# Altium project ControleEsp32.PrjPcb
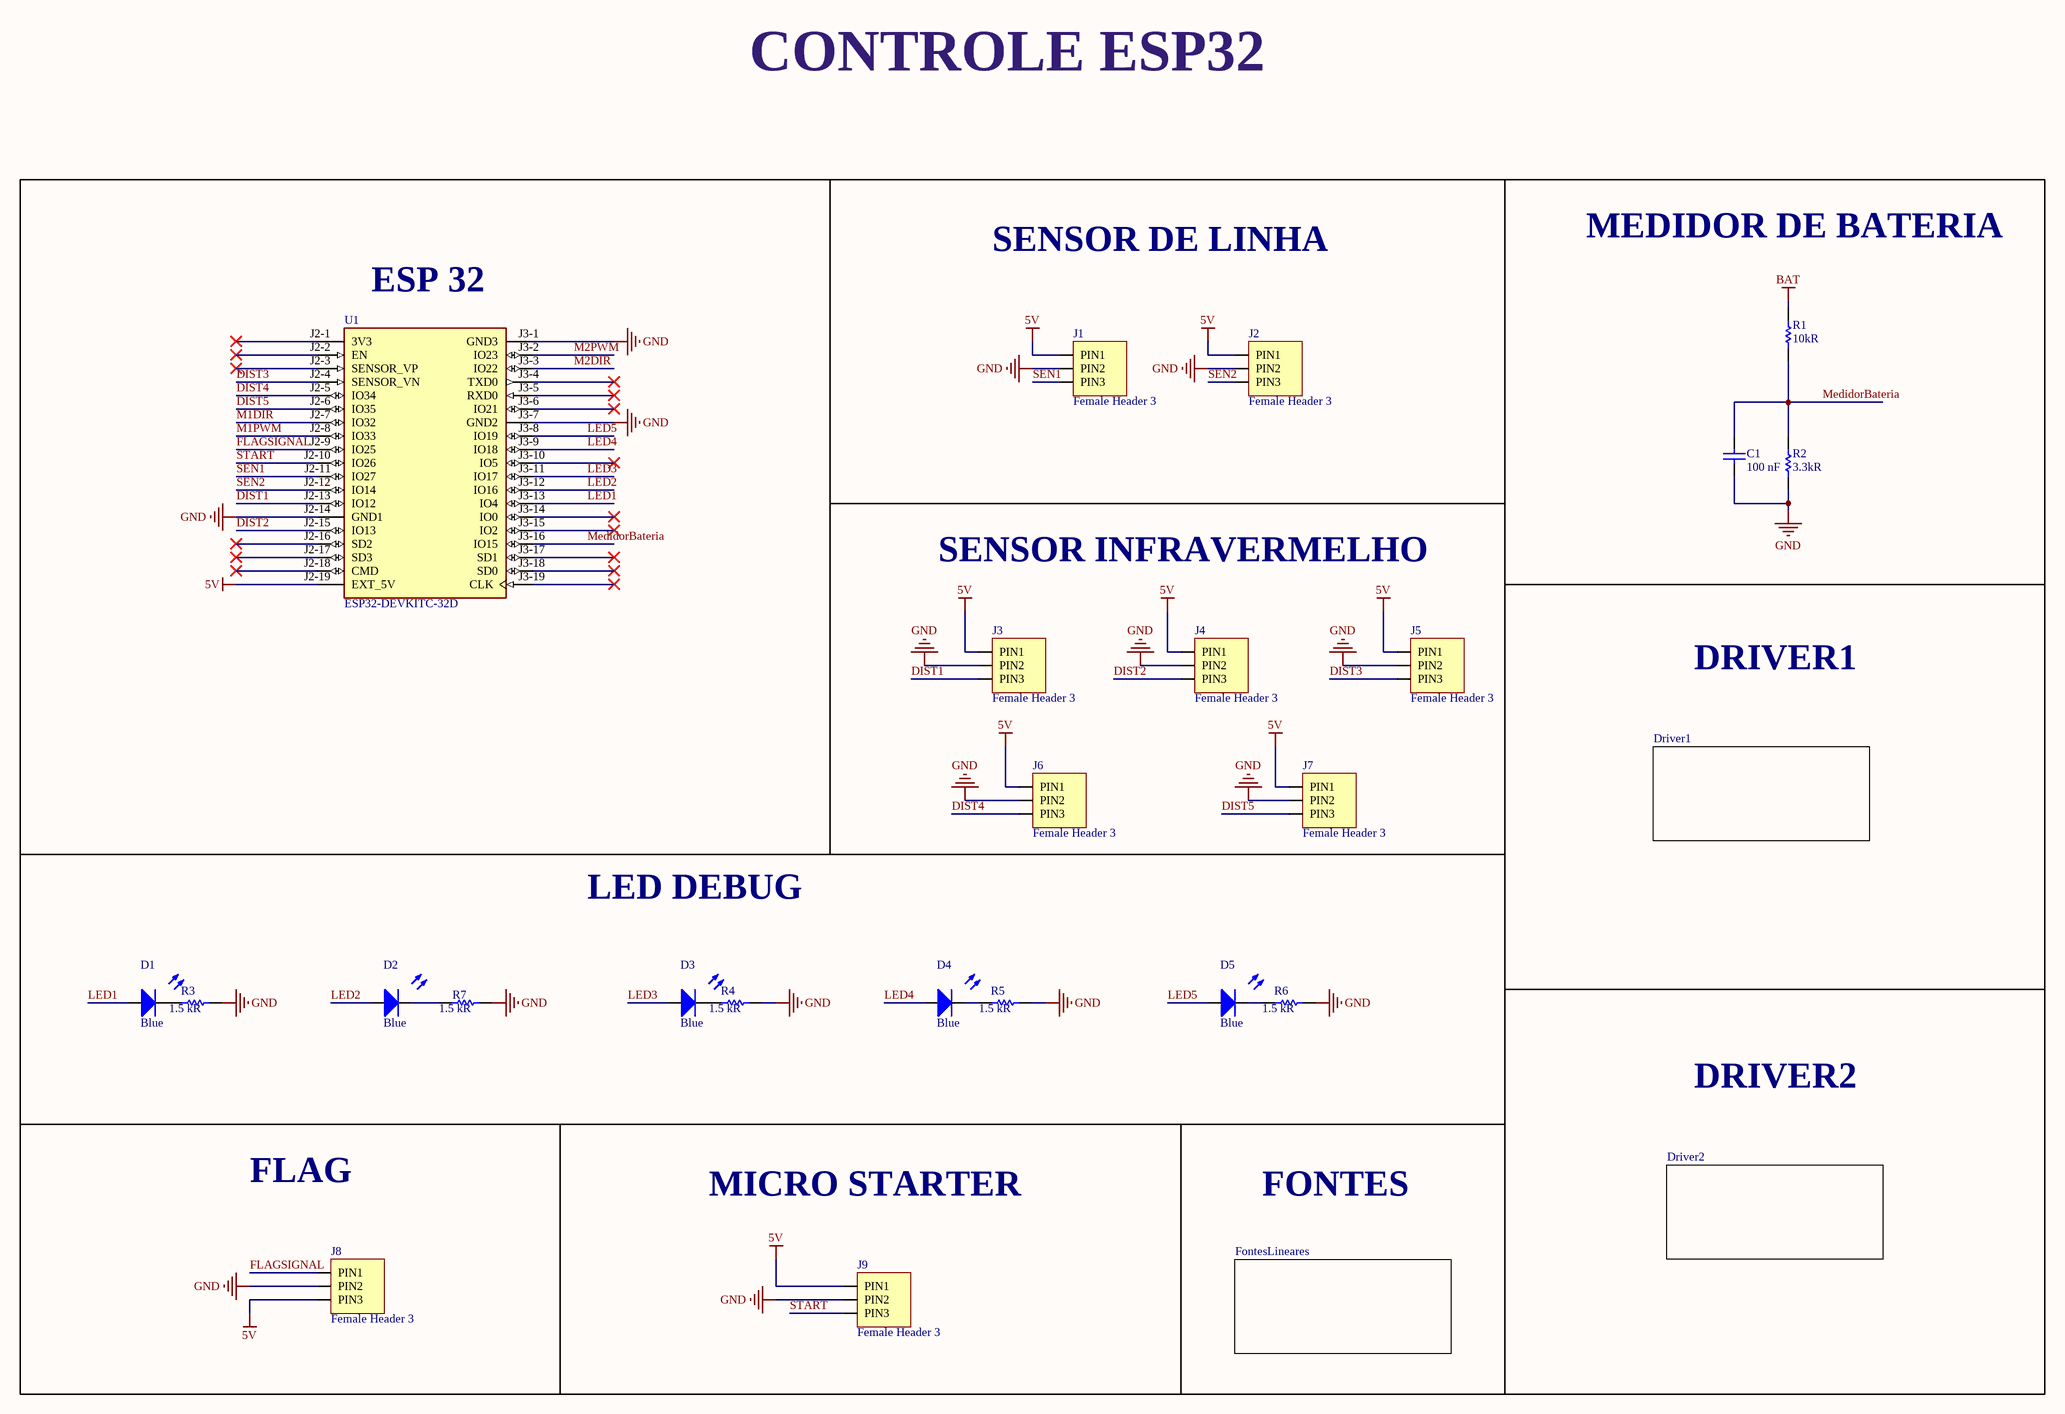
[diagram p0: controleEsp32.SchDoc]
4 sheets, 46 parts. Net scope: global (net labels, ports and power ports of the same name join across sheets).
Board file: ControleEsp32.PcbDoc
Sheets:
  controleEsp32.SchDoc
    FontesLineares = Fonteslineares.SchDoc
    FontesLineares = Driver1.SchDoc
    FontesLineares = Driver2.SchDoc

## Sheet controleEsp32.SchDoc
size A2; SheetNumber: 1; SheetTotal: 4

### Parts
C1  100 nF  [C0805]
D1  Blue  [DIODO_2-SMD-3215]
D2  Blue  [DIODO_2-SMD-3215]
D3  Blue  [DIODO_2-SMD-3215]
D4  Blue  [DIODO_2-SMD-3215]
D5  Blue  [DIODO_2-SMD-3215]
J1  Female Header 3  [FEMALE HEADER 3]
J2  Female Header 3  [FEMALE HEADER 3]
J3  Female Header 3  [FEMALE HEADER 3]
J4  Female Header 3  [FEMALE HEADER 3]
J5  Female Header 3  [FEMALE HEADER 3]
J6  Female Header 3  [FEMALE HEADER 3]
J7  Female Header 3  [FEMALE HEADER 3]
J8  Female Header 3  [FEMALE HEADER 3]
J9  Female Header 3  [FEMALE HEADER 3]
R1  10kR  [RESISTOR_0603]
R2  3.3kR  [RESISTOR_0603]
R3  1.5 kR  [RESISTOR_0805]
R4  1.5 kR  [RESISTOR_0805]
R5  1.5 kR  [RESISTOR_0805]
R6  1.5 kR  [RESISTOR_0805]
R7  1.5 kR  [RESISTOR_0805]
U1  ESP32-DEVKITC-32D  [MODULE_ESP32-DEVKITC-32D]

### Sub-sheets
FontesLineares = FontesLineares: no entries
FontesLineares = Driver1: no entries
FontesLineares = Driver2: no entries

### Nets
5V: J1.PIN1 J2.PIN1 J3.PIN1 J4.PIN1 J5.PIN1 J6.PIN1 J7.PIN1 J8.PIN3 J9.PIN1 U1.J2-19(EXT_5V)
BAT: R1.2
GND: C1.1 J1.PIN2 J2.PIN2 J3.PIN2 J4.PIN2 J5.PIN2 J6.PIN2 J7.PIN2 J8.PIN2 J9.PIN2 R2.1 R3.2 R4.2 R5.2 R6.2 R7.2 U1.J2-14(GND1) U1.J3-1(GND3) U1.J3-7(GND2)
DIST1: J3.PIN3 U1.J2-13(IO12)
DIST2: J4.PIN3 U1.J2-15(IO13)
DIST3: J5.PIN3 U1.J2-4(SENSOR_VN)
DIST4: J6.PIN3 U1.J2-5(IO34)
DIST5: J7.PIN3 U1.J2-6(IO35)
FLAGSIGNAL: J8.PIN1 U1.J2-9(IO25)
LED1: D1.A U1.J3-13(IO4)
LED2: D2.A U1.J3-12(IO16)
LED3: D3.A U1.J3-11(IO17)
LED4: D4.A U1.J3-9(IO18)
LED5: D5.A U1.J3-8(IO19)
M1DIR: U1.J2-7(IO32)
M1PWM: U1.J2-8(IO33)
M2DIR: U1.J3-3(IO22)
M2PWM: U1.J3-2(IO23)
MedidorBateria: C1.2 R1.1 R2.2 U1.J3-16(IO15)
SEN1: J1.PIN3 U1.J2-11(IO27)
SEN2: J2.PIN3 U1.J2-12(IO14)
START: J9.PIN3 U1.J2-10(IO26)
NetD1_C: D1.C R3.1
NetD2_C: D2.C R7.1
NetD3_C: D3.C R4.1
NetD4_C: D4.C R5.1
NetD5_C: D5.C R6.1

Not connected (* = marked no-connect by the designer): U1 J2-1(3V3)* J2-2(EN)* J2-3(SENSOR_VP)* J2-16(SD2)* J2-17(SD3)* J2-18(CMD)* J3-4(TXD0)* J3-5(RXD0)* J3-6(IO21)* J3-10(IO5)* J3-14(IO0)* J3-15(IO2)* J3-17(SD1)* J3-18(SD0)* J3-19(CLK)*

### Notes on the sheet
- CONTROLE ESP32
- SENSOR DE LINHA
- MEDIDOR DE BATERIA
- (near U1) ESP 32
- SENSOR INFRAVERMELHO
- DRIVER1
- LED DEBUG
- DRIVER2
- FLAG
- MICRO STARTER
- FONTES

### Library data of the parts
C1 = 885012207128: CAP CER 100 nF 100V X7R 0805; Manufacturer: Wurth Elektronik; Tolerance: 10%; Voltage - Rated: 100 VDC; Library Control - Checked Footprint: Yes; Supplier 1: Mouser; Part Number: 885012207128; Category: Ceramic capacitor; Price: 1=0,41 10=0,283 100=0,169 1000=0,107 (USD); Supplier Part Number 1: 710-885012207128; Library Ref: Capacitor; Operating Temperature: -55°C ~125ºC; Package / Case: 0805(2012 Metric); Size / Dimension: 2 mm L  x 1.25 mm W x 1.25 mm H; Value: 100 nF; ESR: -; Dieletric: X7R; Library Control - Checked Schematic: Yes; ComponentLink1Description: Datasheet; ComponentLink1URL: https://br.mouser.com/datasheet/2/445/885012207128-1727772.pdf; ComponentLink2Description: Mouser Link; ComponentLink2URL: https://br.mouser.com/ProductDetail/Wurth-Elektronik/885012207128?qs=MLItCLRbWsys1TnbPEYt%252BQ%3D%3D
D1-D5 = EAST3215BA5: LED 75mW BLUE 45MCD 3215; Manufacturer: Everlight Electronics; Current - Forward (If): 20 mA; Voltage - Forward (Vf): 3,30 V; Viewing Angle: 130°; Wavelength: 468 nm; Reverse Voltage: 5 V; Library Control - Checked Footprint: yes; Library Control - Person that Checked Footprint: Lucas; Library Control - Person that did the Last Update Footprint: Stéfany (Ster); Supplier 1: Mouser; Part Number: EAST3215BA5; Category: Standard LEDs - SMD; Price: 1 = 0,3800, 10 = 0,2050, 100 = 0.1080 (USD); Package / Case: 3215; Color: Blue; Operating Temperature: - 40 °C ~ 85 °C; Luminous Intensity: 45 mcd; Library Ref: Diodo/Led; Supplier Part Number 1: 638-EAST3215BA5; Max Power Dissipation: 75 mW; Max Current Rating: 20 mA; Library Control - Checked Schematic: yes; Library Control - Last Update: 13/06/2021 12:45; Library Control - Person that Checked Schematic: Lucas; Library Control - Person that did the Last Update Schematic: Stéfany (Ster); ComponentLink1Description: Mouser Link; ComponentLink1URL: https://www.mouser.com/ProductDetail/Everlight/EAST3215BA5?qs=Cqqh%252BS766wnzp9nQVj5A4g==; ComponentLink2Description: Datasheet; ComponentLink2URL: https://www.mouser.com/datasheet/2/143/EAST3215BA5-1154292.pdf
J1-J9 = Female Header 3: Number of Contacts: 3; System: Connector; Library Ref: Header
R1 = RC0603JR-0710KL: RES SMD 10K OHM 5% 1/10W 0603; Manufacturer: Yageo; Temperature Coefficient: 100 PPM / C; Power Rating: 100 mW (1/10 W); Voltage Rating: 75 V; Library Control - Checked Footprint: No; Library Control - Checked Schematic: Yes; Library Control - Person that Checked Schematic: Marcos; Library Control - Person that did the Last Update Footprint: Dalarme; Supplier 1: Mouser; Part Number: RC0603JR-0710KL; Category: Thick Film Resistors - SMD; Price: 1=0,10, 10=0,015, 100=0,005 1000=0,0040 (USD); Package / Case: 0603 (1608 Metric); Operating Temperature: - 55ºC ~ 155ºC; Value: 10kR; Tolerance: 5 %; Library Ref: Resistor; Resistor Type: Fixo; Size / Dimension: 1.6 mm L x  0.8 mm W x  0.45 mm H; Supplier Part Number 1: 603-RC0603JR-0710KL; Library Control - Last Update: 21/06/21 14:15; Library Control - Person that did the Last Update Schematic: Marcos; ComponentLink1Description: Mouser Link; ComponentLink1URL: https://br.mouser.com/ProductDetail/Yageo/RC0603JR-0710KL?qs=ksOUTF%2FWcd8D6T22BJkQ7g%3D%3D; ComponentLink2Description: Datsheet Link; ComponentLink2URL: https://br.mouser.com/datasheet/2/447/Yageo_03_18_2021_PYu_RC_Group_51_RoHS_L_11-2199992.pdf
R2 = CRGCQ0603F3K3: RES SMD 3.3K OHM 1% 1/10W 0603; Manufacturer: TE Connectivity / Holsworthy; Temperature Coefficient: 100 PPM / C; Power Rating: 100 mW (1/10 W); Voltage Rating: 75 V; Library Control - Checked Footprint: Yes; Library Control - Person that Checked Footprint: Nikaum; Library Control - Person that Checked Schematic: Guilherme; Library Control - Person that did the Last Update Footprint: Dalarme; Supplier 1: Mouser; Part Number: CRGCQ0603F3K3; Category: Thick Film Resistors; Price: 1=0,10, 10=0,029, 100=0,011 (USD); Package / Case: 0603 (1608 Metric); Operating Temperature: - 55ºC ~ 125ºC; Value: 3.3kR; Tolerance: 1 %; Library Ref: Resistor; Resistor Type: Fixed; Size / Dimension: 1.6 mm L x  0.8 mm W x  0.45 mm H; Supplier Part Number 1: 279-CRGCQ0603F3K3; Library Control - Checked Schematic: Yes; Library Control - Last Update: 27/06/2021 20:27; Library Control - Person that did the Last Update Schematic: Dalarme; ComponentLink1Description: Mouser Link; ComponentLink1URL: https://br.mouser.com/ProductDetail/TE-Connectivity-Holsworthy/CRGCQ0603F3K3?qs=sGAEpiMZZMvdGkrng054t7z4BkURc4Lz7mzhBruKq8fwVJ16OlxZFQ%3D%3D; ComponentLink2Description: Datasheet; ComponentLink2URL: https://br.mouser.com/datasheet/2/418/4/NG_DS_1773204-3_1-1358553.pdf
R3-R7 = CRCW08051K50FKEAC: RES SMD 1.5K OHM 1% 1/8W 0805; Manufacturer: Vishay / Dale; Temperature Coefficient: 100 PPM / C; Power Rating: 125 mW (1/8 W); Voltage Rating: 150 V; Library Control - Checked Footprint: Yes; Library Control - Person that Checked Footprint: Nikaum; Library Control - Person that did the Last Update Footprint: Nicolas; Supplier 1: Mouser; Part Number: CRCW08051K50FKEAC; Category: Thick Film Resistors - SMD; Price: 1=0,10, 10=0,059, 100=0,024 (USD); Package / Case: 0805 (2012 Metric); Operating Temperature: -55 C ~ 155 C; Value: 1.5 kR; Tolerance: 1 %; Library Ref: Resistor; Resistor Type: Fixo; Size / Dimension: 2,00 L x 1,25 W x 0,45 H; Supplier Part Number 1: 71-CRCW08051K50FKEAC; Library Control - Checked Schematic: Yes; Library Control - Last Update: 27/06/2021 20:45; Library Control - Person that Checked Schematic: Nikaum; Library Control - Person that did the Last Update Schematic: Nikaum; ComponentLink1Description: Mouser Link; ComponentLink1URL: https://br.mouser.com/ProductDetail/Vishay-Dale/CRCW08051K50FKEAC?qs=E3Y5ESvWgWMwo6R2oqPQ9Q%3D%3D; ComponentLink2Description: Datasheet; ComponentLink2URL: https://br.mouser.com/datasheet/2/427/crcwce3-1762584.pdf
U1 = CMP-041-000000-1: WiFi Development Tools (802.11) ESP32 General Development Kit, ESP32-WROOM-32D on the board; MF: Espressif Systems; Design Item ID: ESP32-DEVKITC-32D; Pin Count: 38; Component Type: Standard; Package: None; SnapEDA_Link: https://www.snapeda.com/parts/ESP32-DEVKITC-32D/Espressif+Systems/view-part/?ref=snap; Source: ESP32-DEVKITC-32D.SchLib; Check_prices: https://www.snapeda.com/parts/ESP32-DEVKITC-32D/Espressif+Systems/view-part/?ref=eda; MP: ESP32-DEVKITC-32D; Value: *

## Sheet Fonteslineares.SchDoc
size A4; SheetNumber: 2; SheetTotal: 4
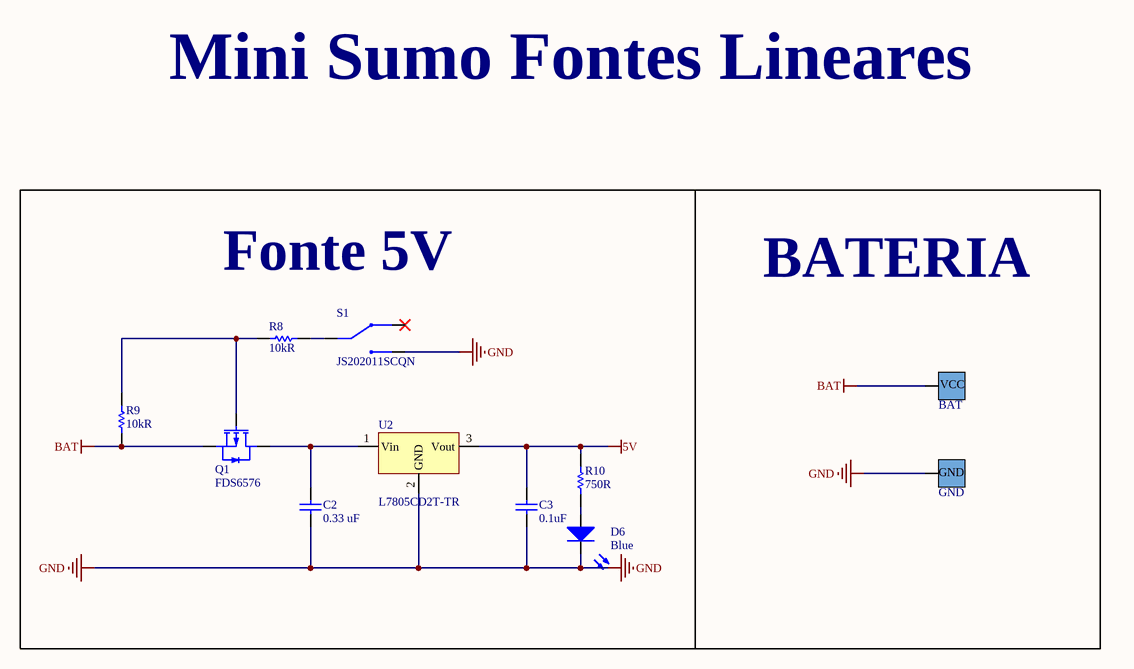
[diagram p1: Fonteslineares.SchDoc]

### Parts
BAT  Source Pad  [PAD_ALIMENTAÇÃO_MINI]  (value not drawn)
C2  0.33 uF  [C0805]
C3  0.1uF  [C0805]
D6  Blue  [DIODO_2-SMD-3215]
GND  Ground Pad  [PAD_ALIMENTAÇÃO_MINI]  (value not drawn)
Q1  FDS6576  [SOIC-8]
R8  10kR  [RESISTOR_0603]
R9  10kR  [RESISTOR_0603]
R10  750R  [RESISTOR_0805]
S1  JS202011SCQN  [DPDT]
U2  L7805CD2T-TR  [D2PAK]

### Nets
5V: C3.2 R10.2 U2.3(Vout)
BAT: BAT.A(VCC) Q1.S R9.1
GND: C2.1 C3.1 D6.C GND.A(GND) S1.A3 U2.2(GND)
NetC2_2: C2.2 Q1.D U2.1(Vin)
NetD6_A: D6.A R10.1
NetQ1_G: Q1.G R8.2 R9.2
NetR8_1: R8.1 S1.A1

Not connected (* = marked no-connect by the designer): S1 A2(4)*

### Notes on the sheet
- Mini Sumo Fontes Lineares
- Fonte 5V
- BATERIA

### Library data of the parts
BAT = Source Pad Mini Sumô: VCC PAD MINI SUMÔ; Cable AWG: 20 / 18 (AWG); Recomended Category: Mini Sumô; Size: 3.5 x 3.5 (mm); Library Ref: Pads
C2 = GCM21BR71E334KA37K: CAP CER 0.33UF 25V X7R 0805; Manufacturer: Murata Eletronics; Tolerance: 10%; Voltage - Rated: 25 VDC; Library Control - Checked Footprint: Yes; Library Control - Person that Checked Footprint: Nikaum; Supplier 1: Mouser; Part Number: GCM21BR71E334KA37K; Category: Ceramic Capacitor; Price: 1= 0,57, 10= 0,398, 100= 0,239 (USD); Supplier Part Number 1: 81-GCM21BR71E334KA7K; Library Ref: Capacitor; Operating Temperature: -55 C ~ 125 C; Package / Case: 0805 (2012 Metric); Size / Dimension: 2,00 L x 1,25 W x 1,25 H; Value: 0.33 uF; Dieletric: X7R; Library Control - Checked Schematic: Yes; Library Control - Last Update: 28/06/2021 00:57; Library Control - Person that Checked Schematic: Nikaum; Library Control - Person that did the Last Update Footprint: Nikaum; Library Control - Person that did the Last Update Schematic: Nikaum; ComponentLink1Description: Datasheet; ComponentLink1URL: https://br.mouser.com/datasheet/2/281/GCM21BR71E334KA37_01-1968656.pdf; ComponentLink2Description: Mouser Link; ComponentLink2URL: https://br.mouser.com/ProductDetail/Murata-Electronics/GCM21BR71E334KA37K?qs=N3Kl9KD794Tg%2FXM5q2uFQQ%3D%3D; ComponentLink3Description: ESR; ComponentLink3URL: https://www.murata.com/en-us/products/productdetail?partno=GCM21BR71E334KA37%23
C3 = C0805C104M3RACTU: CAP CER 0.1uF 25V X7R 0805; Manufacturer: Kemet; Tolerance: 20%; Voltage - Rated: 25 VDC; Library Control - Checked Footprint: No; Library Control - Checked Schematic: Yes; Library Control - Person that Checked Schematic: Guilherme; Library Control - Person that did the Last Update Schematic: Marcos; Supplier 1: Mouser; Part Number: C0805C104M3RACTU; Category: Ceramic Capacitor; Price: 1=0,13 10=0,064 100=0,037 1000=0,025 (USD); Supplier Part Number 1: 80-C0805C104M3R; Library Ref: Capacitor; Operating Temperature: -55 C ~ 125 C; Package / Case: 0805(2012 mestric); Size / Dimension: 1.25 mm W x 2 mm L x 0.78 mm H; Value: 0.1uF; ESR: -; Dieletric: X7R; Library Control - Last Update: 26/06/2021 20:52; ComponentLink1Description: Datasheet; ComponentLink1URL: https://br.mouser.com/datasheet/2/212/KEM_C1002_X7R_SMD-1102033.pdf; ComponentLink2Description: Mouser Link; ComponentLink2URL: https://br.mouser.com/ProductDetail/KEMET/C0805C104M3RACTU?qs=jbCUrP3sAgSIdMuvv9W4Pg%3D%3D
D6 = EAST3215BA5: as D1 on sheet controleEsp32; Supplier 1: Mouser; Part Number: EAST3215BA5; Category: Standard LEDs - SMD; Price: 1 = 0,3800, 10 = 0,2050, 100 = 0.1080 (USD); Package / Case: 3215; Color: Blue; Operating Temperature: - 40 °C ~ 85 °C; Luminous Intensity: 45 mcd; Library Ref: Diodo/Led; Supplier Part Number 1: 638-EAST3215BA5; Max Power Dissipation: 75 mW; Max Current Rating: 20 mA; Library Control - Checked Schematic: yes; Library Control - Last Update: 13/06/2021 12:45; Library Control - Person that Checked Schematic: Lucas; Library Control - Person that did the Last Update Schematic: Stéfany (Ster); ComponentLink1Description: Mouser Link; ComponentLink1URL: https://www.mouser.com/ProductDetail/Everlight/EAST3215BA5?qs=Cqqh%252BS766wnzp9nQVj5A4g==; ComponentLink2Description: Datasheet; ComponentLink2URL: https://www.mouser.com/datasheet/2/143/EAST3215BA5-1154292.pdf
GND = Ground Pad Mini Sumô: GND PAD MINI SUMÔ; Cable AWG: 20 / 18 (AWG); Recomended Category: Mini Sumô; Size: 3.5 x 3.5 (mm); Library Ref: Pads
Q1 = FDS6576: MOSFET P-CH 20V 11A SOIC-8; Manufacturer: onsemi / Fairchild; FET Type: P-Channel; Rds On (Max) @ Id, Vgs: 23mOhms @ -11A, -4.5V; Input Capacitance (Ciss) (Max) @Vds: 4044pF@-10V; Drain to Source Voltage (Vds): -20V; Vgs(th) (Max) Id: -1.5V@-250uA; Current - Continuous Drain (Id) @25°C: -11A; Gate Charge (Qg) (Max) @ Vgs: 60nC@-4.5V; Power Dissipation (Max): 2.5W; Drive Voltage (Max Rds On, Min Rds On): -2.5V ~4.5V; Vgs (Max): 12V; Rise / Fall Time (Typ): 17 / 79 (ns); Part Number: SOIC-8; Price: 1=1.34, 10=1.20, 100=0.932, 500=0.77, 1000=0.608 (USD); Package / Case: SOIC-8; Operating Temperature: -55 °C ~150 °C; Supplier 1: Mouser; Library Ref: Mosfet; Supplier Part Number 1: 512-FDS6576; ComponentLink1Description: Datasheet; ComponentLink1URL: https://br.mouser.com/datasheet/2/308/1/FDS6576_D-1808687.pdf; ComponentLink2Description: Mouser; ComponentLink2URL: https://br.mouser.com/ProductDetail/onsemi-Fairchild/FDS6576?qs=FOlmdCx%252BAA1N14vq5QZP7Q%3D%3D
R8 R9 = RC0603JR-0710KL: as R1 on sheet controleEsp32; Supplier 1: Mouser; Part Number: RC0603JR-0710KL; Category: Thick Film Resistors - SMD; Price: 1=0,10, 10=0,015, 100=0,005 1000=0,0040 (USD); Package / Case: 0603 (1608 Metric); Operating Temperature: - 55ºC ~ 155ºC; Value: 10kR; Tolerance: 5 %; Library Ref: Resistor; Resistor Type: Fixo; Size / Dimension: 1.6 mm L x  0.8 mm W x  0.45 mm H; Supplier Part Number 1: 603-RC0603JR-0710KL; Library Control - Last Update: 21/06/21 14:15; Library Control - Person that did the Last Update Schematic: Marcos; ComponentLink1Description: Mouser Link; ComponentLink1URL: https://br.mouser.com/ProductDetail/Yageo/RC0603JR-0710KL?qs=ksOUTF%2FWcd8D6T22BJkQ7g%3D%3D; ComponentLink2Description: Datsheet Link; ComponentLink2URL: https://br.mouser.com/datasheet/2/447/Yageo_03_18_2021_PYu_RC_Group_51_RoHS_L_11-2199992.pdf
R10 = ERJ-6GEYJ751V: RES SMD 750 OHM 5% 1/8W 0805; Manufacturer: Panasonic; Temperature Coefficient: 200 PPM / C; Power Rating: 125 mW (1/8 W); Voltage Rating: 150 V; Library Control - Checked Footprint: Yes; Library Control - Person that Checked Footprint: Nikaum; Library Control - Person that Checked Schematic: Guilherme; Library Control - Person that did the Last Update Footprint: Dalarme; Supplier 1: Mouser; Part Number: ERJ-6GEYJ751V; Category: Thick Film Resistors - SMD; Price: 1=0,10, 10=0,055, 100=0,021 (USD); Package / Case: 0805 (2012 Metric); Operating Temperature: - 55ºC ~ 155ºC; Value: 750R; Tolerance: 5 %; Library Ref: Resistor; Resistor Type: Fixed; Size / Dimension: 2 mm L x  1.25 mm W x  0.6 mm H; Supplier Part Number 1: 667-ERJ-6GEYJ751V; Library Control - Checked Schematic: Yes; Library Control - Last Update: 27/06/2021 20:29; Library Control - Person that did the Last Update Schematic: Nikaum; ComponentLink1Description: Mouser Link; ComponentLink1URL: https://br.mouser.com/ProductDetail/Panasonic/ERJ-6GEYJ751V?qs=sGAEpiMZZMukHu%252BjC5l7YYjpZ9X9PhOCxoCk8Svj5Vk%3D; ComponentLink2Description: Datasheet; ComponentLink2URL: https://br.mouser.com/datasheet/2/315/AOA0000C301-1488782.pdf
S1 = JS202011SCQN: DEEP SWITCH 4 POSITIONS; Manufacturer: C&K; Current Rating: 300 mA; Voltage Rating DC: 30 VDC; Switch Function: ON - ON; Library Control - Checked Footprint: Yes; Library Control - Person that Checked Footprint: Nikaum; Part Number: JS202011SCQN; Operating Temperature(max - min): -20~70°C; Supplier: Mouser; ComponentLink1Description: Mouser Link; ComponentLink1URL: https://br.mouser.com/ProductDetail/CK/JS202011SCQN?qs=LgMIjt8LuD95JYWxZ7NvZA%3D%3D; ComponentLink2Description: Datasheet Link; ComponentLink2URL: https://www.mouser.com/datasheet/2/60/js-1841892.pdf; Mouser Part Number: 611-JS202011SCQN; Library Ref: Diversos; Library Control - Last Update: 15/06/2021; Library Control - Person that Checked Schematic: Nikaum; Library Control - Person that did the Last Update Footprint: Nikaum; Library Control - Person that did the Last Update Schematic: Nikaum; Library Control - Checked Schematic: Yes
U2 = L7805CD2T-TR: IC REG LINEAR 5V 1A D2PAK; Manufacturer: ST; Max Power Dissipation: Internally Limited; Output Type: Fixed; Number of Regulators: 1; Voltage - Input (Max): 35V; Current - Quiescent (Iq): 8mA; Voltage - Dropout (Max): 2V; Library Control - Checked Footprint: Yes; Library Control - Person that Checked Footprint: Nícolas; Voltage - Output (Max): 5.25V; Supplier 1: Mouser; Part Number: L7805CD2T-TR; Library Ref: Voltage Regulator; Category: Linear Voltage Regulator; Price: 1=0,93, 10=0,83, 100=0,79 (USD); Package/ Case: D2PAK; Operating Temperature: -40~125 ºC; Voltage - Output (Min/Fixed): 5V; Supplier Part Number 1: 511-L7805CD2T-TR; Library Control - Checked Schematic: Yes; Library Control - Last Update: 25/06/21; Library Control - Person that Checked Schematic: Nícolas; Library Control - Person that did the Last Update Schematic: Nícolas; Current - Output: 1A; Power Dissipation: Internally Limited; ComponentLink1Description: Mouser Link; ComponentLink1URL: https://br.mouser.com/ProductDetail/STMicroelectronics/L7805CD2T-TR?qs=%2Fha2pyFadujE9KQ1BxQHaLKqcK8XYkwQA8UfL%2FIGb8dfQq%2Fq%2FT%2Fjqg%3D%3D; ComponentLink2Description: Datasheet; ComponentLink2URL: https://br.mouser.com/datasheet/2/389/cd00000444-1795274.pdf

## Sheet Driver1.SchDoc
size A4; SheetNumber: 3; SheetTotal: 4
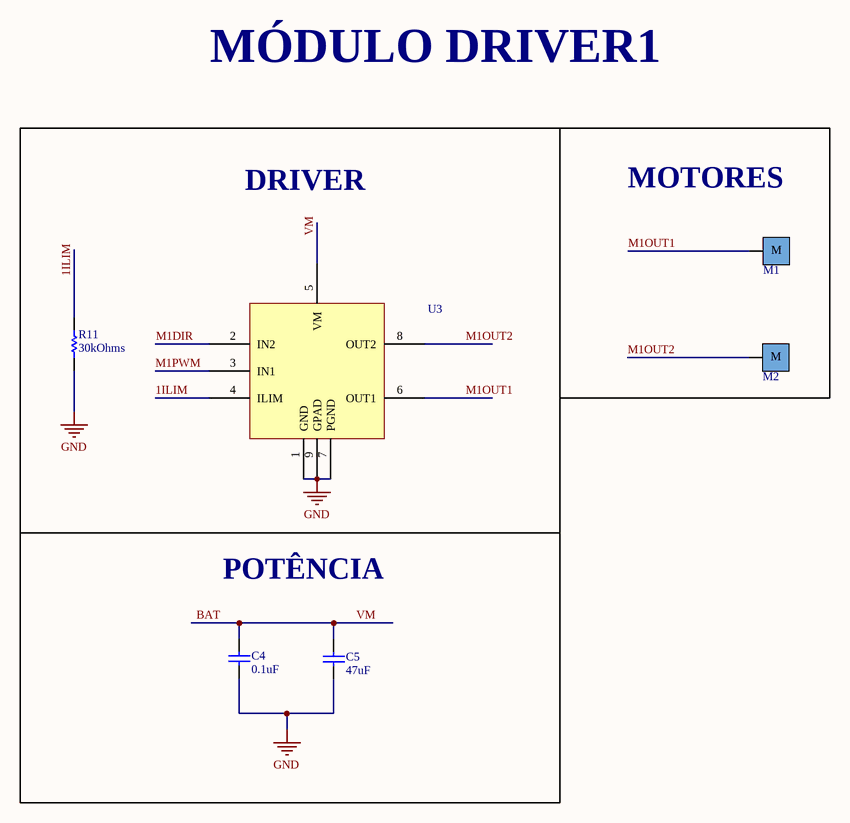
[diagram p2: Driver1.SchDoc]

### Parts
C4  0.1uF  [C0805]
C5  47uF  [C1210]
M1  Motor Pad  [PAD_MOTOR_MINI]  (value not drawn)
M2  Motor Pad  [PAD_MOTOR_MINI]  (value not drawn)
R11  30kOhms  [RESC1608X55N]
U3  DRV8871DDA  [SO-PowerPad-8(8_pins)]  (value not drawn)

### Blocks framed on the sheet
DRIVER: R11 U3

### Nets
BAT: C4.2 C5.2 U3.5(VM)  [also labelled VM]
GND: C4.1 C5.1 R11.2 U3.1(GND) U3.7(PGND) U3.9(GPAD)
1ILIM: R11.1 U3.4(ILIM)
M1DIR: U3.2(IN2)
M1OUT1: M1.M U3.6(OUT1)
M1OUT2: M2.M U3.8(OUT2)
M1PWM: U3.3(IN1)

### Notes on the sheet
- MÓDULO DRIVER1
- MOTORES
- POTÊNCIA

### Library data of the parts
C4 = C0805C104M3RACTU: CAP CER 100nF 25V X7R 0805; Manufacturer: Kemet; Tolerance: 20%; Voltage - Rated: 25 VDC; Library Control - Checked Footprint: Yes; Library Control - Person that Checked Footprint: Cage; Supplier 1: Mouser; Part Number: C0805C104M3RACTU; Category: Ceramic Capacitor; Price: 1=0,13 10=0,064 100=0,037 1000=0,025 (USD); Supplier Part Number 1: 80-C0805C104M3R; Library Ref: Capacitor; Operating Temperature: -55 C ~ 125 C; Package / Case: 0805(2012 mestric); Size / Dimension: 1.25 mm W x 2 mm L x 0.78 mm H; Value: 0.1uF; ESR: -; Dieletric: X7R; Library Control - Checked Schematic: Yes; Library Control - Last Update: 25/08/22; Library Control - Person that Checked Schematic: Cage; Library Control - Person that did the Last Update Footprint: Cage; Library Control - Person that did the Last Update Schematic: Cage; ComponentLink1Description: Datasheet; ComponentLink1URL: https://br.mouser.com/datasheet/2/212/KEM_C1002_X7R_SMD-1102033.pdf; ComponentLink2Description: Mouser Link; ComponentLink2URL: https://br.mouser.com/ProductDetail/KEMET/C0805C104M3RACTU?qs=jbCUrP3sAgSIdMuvv9W4Pg%3D%3D
C5 = GRM32EC81C476KE15K: CAP CER 47uF 16V X6S 1210; Manufacturer: Murata; Tolerance: 10%; Library Control - Checked Footprint: Yes; Library Control - Person that Checked Footprint: Cage; Library Control - Person that did the Last Update Footprint: Prisma; Supplier 1: Mouser; Part Number: GRM32EC81C476KE15K; Category: Ceramic Capacitor; Price: 1=0,59 10=0,314 100=0,274 (USD); Supplier Part Number 1: 81-GRM32EC81C476KE5K; Library Ref: Capacitor; Operating Temperature: -55°C ~ 105°C; Package / Case: 1210 (3225 metric); Size / Dimension: 3.2mm x 2.5mm x 2.5mm; Value: 47uF; Voltage - Rated: 16V; ESR: -; Dieletric: X6S; Library Control - Checked Schematic: Yes; Library Control - Last Update: 22/08/22; Library Control - Person that Checked Schematic: Cage; Library Control - Person that did the Last Update Schematic: Prisma; ComponentLink1Description: Datasheet; ComponentLink1URL: https://br.mouser.com/datasheet/2/281/1/GRM32EC81C476KE15_01A-1988154.pdf; ComponentLink2Description: Mouser Link; ComponentLink2URL: https://br.mouser.com/ProductDetail/Murata-Electronics/GRM32EC81C476KE15K?qs=pba5EUA0Y0ZfNhWUOosFbg%3D%3D
M1 M2 = Motor Pad Mini Sumô: Cable AWG: 20 / 18 (AWG); Recomended Category: Mini Sumô; Size: 3.5 x 3.5 (mm); Library Ref: Pads
R11 = RC0603FR-0730KL: RES SMD 30 kOHMS 1% 1/10W 0603; Manufacturer: YAGEO; Temperature Coefficient: 100 PPM / C; Power Rating: 100 mW (1/10 W); Voltage Rating: 50 V; Library Control - Checked Footprint: Yes; Library Control - Person that Checked Footprint: Guilherme; Supplier 1: Mouser; Part Number: RC0603FR-0730KL; Category: Thick Film Resistors - SMD; Price: 1=0,10, 10=0,024, 100=0,01(USD); Package / Case: 0603 (1608 Metric); Operating Temperature: - 55°C ~ 155°C; Value: 30kOhms; Tolerance: 1 %; Library Ref: Resistor; Resistor Type: Fixo; Size / Dimension: 1,6 L x 0,8 W x 0,45 H; Supplier Part Number 1: 603-RC0603FR-0730KL; Library Control - Checked Schematic: Yes; Library Control - Last Update: 24/07/2021 11:34; Library Control - Person that Checked Schematic: Guilherme; Library Control - Person that did the Last Update Footprint: Guilherme; Library Control - Person that did the Last Update Schematic: Guilherme; ComponentLink1Description: Mouser Link; ComponentLink1URL: https://br.mouser.com/ProductDetail/YAGEO/RC0603FR-0730KL?qs=diQw95jMAeNFr44yr782FQ%3D%3D; ComponentLink2Description: Datasheet; ComponentLink2URL: https://br.mouser.com/datasheet/2/447/Yageo_03_18_2021_PYu_RC_Group_51_RoHS_L_11-2199992.pdf
U3 = DRV8871DDA: IC MTR DRV (6.5V ~ 45V) (3.5 A) SO-PowerPad-8; Manufacturer: Texas Instruments; Suplier Part Number 1: 595-DRV8871DDA; Operating Supply Current: 3mA; Current - Peak Output (Source, Sink): 3.6A / 3.6A; Current - Output: 3.5A; Power Dissipation: Irms^2 (HighSide Rds(On) + LowSide Rds(On)); Output Configuration: Half Bridge (2); Logic Voltage - VIL, VIH: VIL=0.5V / VIH=1.5V; Library Control - Checked Schematic: Yes; Library Control - Person that Checked Schematic: Stéfany (Ster); Library Control - Person that did the Last Update Footprint: Maria Laura; Logic (IN-SD/High Low): IN-SD; Rds On - Drain-Source Resistance: 565m ohm; Category: Driver; Supplier 1: Mouser; Part Number: DRV8871DDA; Price: 1=3,15000, 10=2,84000, 100=2,31000 (USD); Technology: Power MOSFET; Package / Case: SO-PowerPad-8; Voltage - Load: (6.5V ~ 45V); Voltage - Supply: (6.5V ~ 45V); Operating Temperature: -40°C ~ 125°C; Library Ref: Driver; Library Control - Checked Footprint: Yes; Library Control - Last Update: 12/06/2021 17:04; Library Control - Person that Checked Footprint: Stéfany (Ster); Library Control - Person that did the Last Update Schematic: Stéfany (Ster); ComponentLink1Description: Mouser Link / ST Link; ComponentLink1URL: https://br.mouser.com/ProductDetail/Texas-Instruments/DRV8871DDA?qs=Fobv33ltQGiluwfB07aSBw%3D%3D; ComponentLink2Description: Datasheet; ComponentLink2URL: https://www.ti.com/lit/ds/symlink/drv8871.pdf?HQS=dis-mous-null-mousermode-dsf-pf-null-wwe&ts=1623013148488&ref_url=https%253A%252F%252Fwww.google.com%252F

## Sheet Driver2.SchDoc
size A4; SheetNumber: 4; SheetTotal: 4
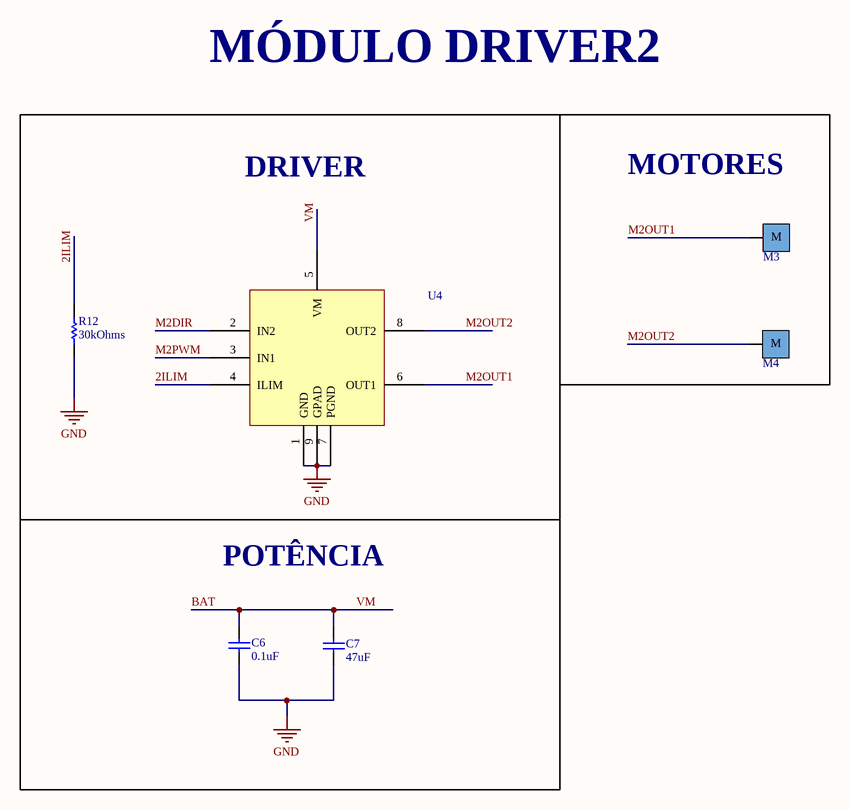
[diagram p3: Driver2.SchDoc]

### Parts
C6  0.1uF  [C0805]
C7  47uF  [C1210]
M3  Motor Pad  [PAD_MOTOR_MINI]  (value not drawn)
M4  Motor Pad  [PAD_MOTOR_MINI]  (value not drawn)
R12  30kOhms  [RESC1608X55N]
U4  DRV8871DDA  [SO-PowerPad-8(8_pins)]  (value not drawn)

### Blocks framed on the sheet
DRIVER: R12 U4

### Nets
BAT: C6.2 C7.2 U4.5(VM)  [also labelled VM]
GND: C6.1 C7.1 R12.2 U4.1(GND) U4.7(PGND) U4.9(GPAD)
2ILIM: R12.1 U4.4(ILIM)
M2DIR: U4.2(IN2)
M2OUT1: M3.M U4.6(OUT1)
M2OUT2: M4.M U4.8(OUT2)
M2PWM: U4.3(IN1)

### Notes on the sheet
- MÓDULO DRIVER2
- MOTORES
- POTÊNCIA

### Library data of the parts
C6 = C0805C104M3RACTU: as C4 on sheet Driver1; Supplier 1: Mouser; Part Number: C0805C104M3RACTU; Category: Ceramic Capacitor; Price: 1=0,13 10=0,064 100=0,037 1000=0,025 (USD); Supplier Part Number 1: 80-C0805C104M3R; Library Ref: Capacitor; Operating Temperature: -55 C ~ 125 C; Package / Case: 0805(2012 mestric); Size / Dimension: 1.25 mm W x 2 mm L x 0.78 mm H; Value: 0.1uF; ESR: -; Dieletric: X7R; Library Control - Checked Schematic: Yes; Library Control - Last Update: 25/08/22; Library Control - Person that Checked Schematic: Cage; Library Control - Person that did the Last Update Footprint: Cage; Library Control - Person that did the Last Update Schematic: Cage; ComponentLink1Description: Datasheet; ComponentLink1URL: https://br.mouser.com/datasheet/2/212/KEM_C1002_X7R_SMD-1102033.pdf; ComponentLink2Description: Mouser Link; ComponentLink2URL: https://br.mouser.com/ProductDetail/KEMET/C0805C104M3RACTU?qs=jbCUrP3sAgSIdMuvv9W4Pg%3D%3D
C7 = GRM32EC81C476KE15K: as C5 on sheet Driver1; Supplier 1: Mouser; Part Number: GRM32EC81C476KE15K; Category: Ceramic Capacitor; Price: 1=0,59 10=0,314 100=0,274 (USD); Supplier Part Number 1: 81-GRM32EC81C476KE5K; Library Ref: Capacitor; Operating Temperature: -55°C ~ 105°C; Package / Case: 1210 (3225 metric); Size / Dimension: 3.2mm x 2.5mm x 2.5mm; Value: 47uF; Voltage - Rated: 16V; ESR: -; Dieletric: X6S; Library Control - Checked Schematic: Yes; Library Control - Last Update: 22/08/22; Library Control - Person that Checked Schematic: Cage; Library Control - Person that did the Last Update Schematic: Prisma; ComponentLink1Description: Datasheet; ComponentLink1URL: https://br.mouser.com/datasheet/2/281/1/GRM32EC81C476KE15_01A-1988154.pdf; ComponentLink2Description: Mouser Link; ComponentLink2URL: https://br.mouser.com/ProductDetail/Murata-Electronics/GRM32EC81C476KE15K?qs=pba5EUA0Y0ZfNhWUOosFbg%3D%3D
M3 M4 = Motor Pad Mini Sumô: Cable AWG: 20 / 18 (AWG); Recomended Category: Mini Sumô; Size: 3.5 x 3.5 (mm); Library Ref: Pads
R12 = RC0603FR-0730KL: as R11 on sheet Driver1; Supplier 1: Mouser; Part Number: RC0603FR-0730KL; Category: Thick Film Resistors - SMD; Price: 1=0,10, 10=0,024, 100=0,01(USD); Package / Case: 0603 (1608 Metric); Operating Temperature: - 55°C ~ 155°C; Value: 30kOhms; Tolerance: 1 %; Library Ref: Resistor; Resistor Type: Fixo; Size / Dimension: 1,6 L x 0,8 W x 0,45 H; Supplier Part Number 1: 603-RC0603FR-0730KL; Library Control - Checked Schematic: Yes; Library Control - Last Update: 24/07/2021 11:34; Library Control - Person that Checked Schematic: Guilherme; Library Control - Person that did the Last Update Footprint: Guilherme; Library Control - Person that did the Last Update Schematic: Guilherme; ComponentLink1Description: Mouser Link; ComponentLink1URL: https://br.mouser.com/ProductDetail/YAGEO/RC0603FR-0730KL?qs=diQw95jMAeNFr44yr782FQ%3D%3D; ComponentLink2Description: Datasheet; ComponentLink2URL: https://br.mouser.com/datasheet/2/447/Yageo_03_18_2021_PYu_RC_Group_51_RoHS_L_11-2199992.pdf
U4 = DRV8871DDA: as U3 on sheet Driver1; Category: Driver; Supplier 1: Mouser; Part Number: DRV8871DDA; Price: 1=3,15000, 10=2,84000, 100=2,31000 (USD); Technology: Power MOSFET; Package / Case: SO-PowerPad-8; Voltage - Load: (6.5V ~ 45V); Voltage - Supply: (6.5V ~ 45V); Operating Temperature: -40°C ~ 125°C; Library Ref: Driver; Library Control - Checked Footprint: Yes; Library Control - Last Update: 12/06/2021 17:04; Library Control - Person that Checked Footprint: Stéfany (Ster); Library Control - Person that did the Last Update Schematic: Stéfany (Ster); ComponentLink1Description: Mouser Link / ST Link; ComponentLink1URL: https://br.mouser.com/ProductDetail/Texas-Instruments/DRV8871DDA?qs=Fobv33ltQGiluwfB07aSBw%3D%3D; ComponentLink2Description: Datasheet; ComponentLink2URL: https://www.ti.com/lit/ds/symlink/drv8871.pdf?HQS=dis-mous-null-mousermode-dsf-pf-null-wwe&ts=1623013148488&ref_url=https%253A%252F%252Fwww.google.com%252F

## Nets that join several sheets
5V: controleEsp32 (10 pins), Fonteslineares (C3.2 R10.2 U2.3)
BAT: controleEsp32 (R1.2), Fonteslineares (BAT.A Q1.S R9.1), Driver1 (C4.2 C5.2 U3.5), Driver2 (C6.2 C7.2 U4.5)
GND: controleEsp32 (19 pins), Fonteslineares (6 pins), Driver1 (6 pins), Driver2 (6 pins)
M1DIR: controleEsp32 (U1.J2-7), Driver1 (U3.2)
M1PWM: controleEsp32 (U1.J2-8), Driver1 (U3.3)
M2DIR: controleEsp32 (U1.J3-3), Driver2 (U4.2)
M2PWM: controleEsp32 (U1.J3-2), Driver2 (U4.3)